# EAGLE design Pwrmon (EAGLE 6.5.0)
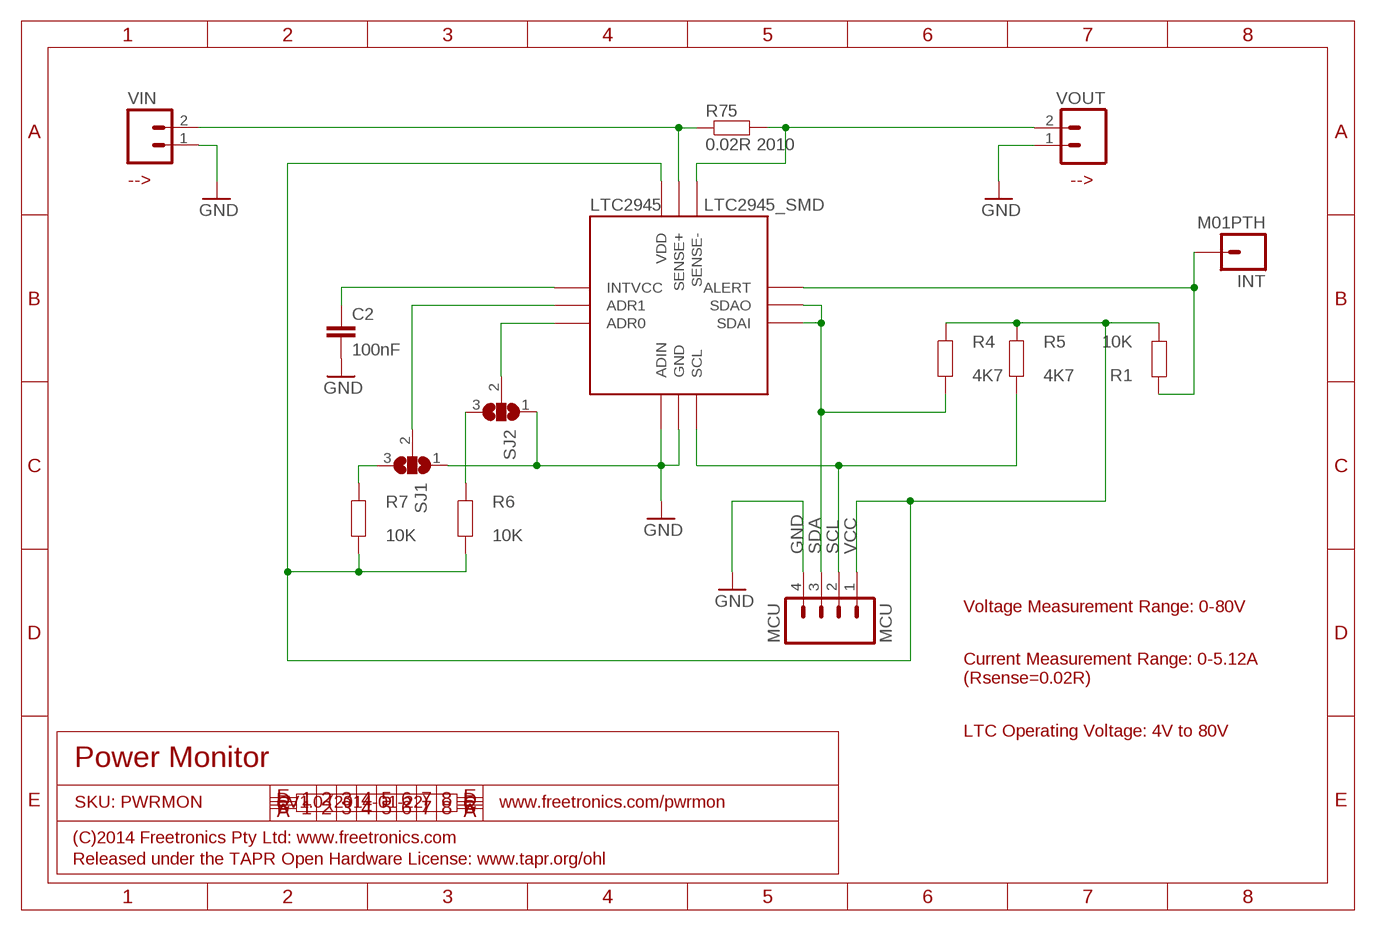
[diagram p0: schematic, sheet 1]

## Parts
C2  100nF  CAP0603  [0603]
INT  M01PTH  [1X01]
LTC2945  LTC2945_SMD  [QFN-12]
MCU  MCU  M04PTH  [1X04]
R1  10K  RESISTOR0603  [0603]
R4  4K7  RESISTOR0603  [0603]
R5  4K7  RESISTOR0603  [0603]
R6  10K  RESISTOR0603  [0603]
R7  10K  RESISTOR0603  [0603]
R75  0.02R 2010  RESISTOR2010  [R2010]
SJ1  SJ2W  [SJ_2]
SJ2  SJ2W  [SJ_2]
VIN  M02PTH  [1X02]
VOUT  M02PTH  [1X02]

## Nets
GND: C2.2 LTC2945.4(ADIN) LTC2945.5(GND) MCU.4 SJ1.1 SJ2.1 VIN.1 VOUT.1
N$1: LTC2945.11(SENSE+) R75.1 VIN.2
N$2: LTC2945.10(SENSE-) R75.2 VOUT.2
N$3: LTC2945.2(ADR1) SJ1.2
N$4: INT.1 LTC2945.9(ALERT) R1.2
N$5: C2.1 LTC2945.1(INTVCC)
N$6: LTC2945.3(ADR0) SJ2.2
N$11: R7.2 SJ1.3
N$12: R6.2 SJ2.3
SCL: LTC2945.6(SCL) MCU.2 R5.1
SDA: LTC2945.7(SDAI) LTC2945.8(SDAO) MCU.3 R4.1
VCC: LTC2945.12(VDD) MCU.1 R1.1 R4.2 R5.2 R6.1 R7.1

## Notes on the sheet
- --> | -->
- Voltage Measurement Range: 0-80V
- Current Measurement Range: 0-5.12A
  (Rsense=0.02R)
- LTC Operating Voltage: 4V to 80V
- Power Monitor
- SKU: PWRMON | V1.0 (2014-01-22) | www.freetronics.com/pwrmon
- (C)2014 Freetronics Pty Ltd: www.freetronics.com
- Released under the TAPR Open Hardware License: www.tapr.org/ohl

## Library data of the parts
C2 = freetronics-master-v1:CAP: Capacitor Standard 0603 ceramic capacitor, and 0.1" leaded capacitor.
INT = freetronics-master-v1.1:M01: Header 1 Standard 1-pin 0.1" header. Use with straight break away headers (SKU : PRT-00116), right angle break away headers (PRT-00553), swiss pins (PRT-00743), machine pins (PRT-00117), and female headers (PRT-00115).
LTC2945 = freetronics-original:LTC2945
MCU = freetronics-master-v1:M04: Header 4 Standard 4-pin 0.1" header. Use with straight break away headers (SKU : PRT-00116), right angle break away headers (PRT-00553), swiss pins (PRT-00743), machine pins (PRT-00117), and female headers (PRT-00115). Molex polarized connector foot print use with SKU : PRT-08231 with associated crimp pins and housings.
R1 R4-R7 = freetronics-master-v1:RESISTOR: Resistor Basic schematic elements and footprints for 0603, 1206, and PTH 1/10th watt (small) resistors.
R75 = freetronics-original:RESISTOR: Resistor Basic schematic elements and footprints for 0603, 1206, and PTH 1/10th watt (small) resistors.
SJ1 SJ2 = freetronics-master-v1.1:SJ2W: SMD solder JUMPER
VIN VOUT = freetronics-master-v1.1:M02: Header 2 Standard 2-pin 0.1" header. Use with straight break away headers (SKU : PRT-00116), right angle break away headers (PRT-00553), swiss pins (PRT-00743), machine pins (PRT-00117), and female headers (PRT-00115). Molex polarized connector foot print use with SKU : PRT-08233 with associated crimp pins and housings.

## Board
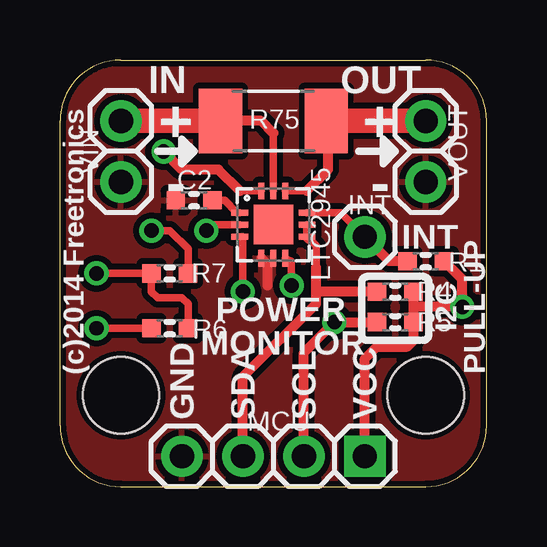
[diagram p1: board, top side]
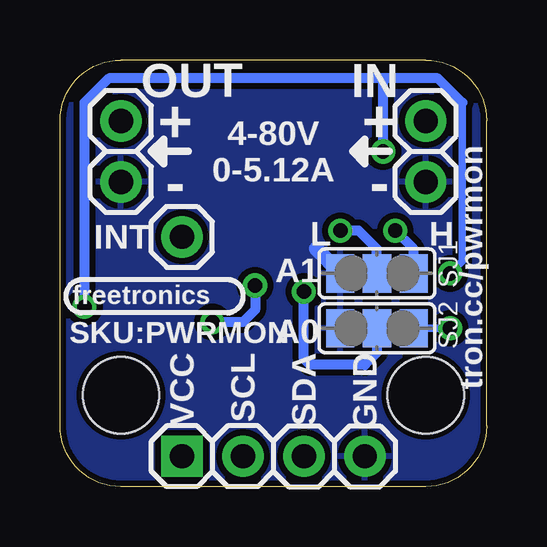
[diagram p2: board, bottom side, seen from below]

Size 17.78 x 17.78 mm. Coordinates in mm from the lower left corner, seen from the top.
Outline: 15.24,0 arc90 17.78,2.54 17.78,15.24 arc90 15.24,17.78 2.54,17.78 arc90 0,15.24 0,2.54 arc90 2.54,0 15.24,0
Copper layers (1*16): Top 0.035mm / dielectric 1.5mm / Bottom 0.035mm
Design rules "default *": minimum track width 8mil, minimum drill 15mil, track to track 10mil, track to pad 10mil, pad to pad 10mil, via to via 10mil, smd to smd 8mil, copper to edge 10mil, drill to drill 8mil, minimum pad ring 14mil, minimum via ring 8mil, stop-mask expansion 4mil, vias tented up to drill 25mil, thermal gap 10mil
Holes 3.17 mm at 15.24,3.81 2.54,3.81

### Footprints (pad centres in the part's own frame; a part is rotated, then mirrored left to right if it is on the bottom)
0603 = smd 0.762 x 0.762: 1 -0.762,0; 2 0.762,0
1X01 = drill 1.016: 1 0,0
QFN-12 = smd 0.7 x 0.25: 1 -1.4,0.5; 2 -1.4,0; 3 -1.4,-0.5; 7 1.4,-0.5; 8 1.4,0; 9 1.4,0.5 | smd 0.25 x 0.7: 4 -0.5,-1.4; 5 0,-1.4; 6 0.5,-1.4; 10 0.5,1.4; 11 0,1.4; 12 -0.5,1.4 | smd 1.65 x 1.65: PAD 0,0
1X04 = drill 1.016 square: 1 0,0 | drill 1.016: 2 2.54,0; 3 5.08,0; 4 7.62,0
R2010 = smd 1.8 x 2.7: 1 -2.2,0; 2 2.2,0
SJ_2 = smd 1.168 x 1.6: 1 -1.524,0; 2 0,0; 3 1.524,0
1X02 = drill 1.016: 1 0,0; 2 2.54,0

### Placement (x,y rotation side)
C2  5.59,11.94 180 top
INT  12.7,10.41 0 top
LTC2945  8.89,10.92 0 top
MCU  12.7,1.27 180 top
R1  15.24,9.4 180 top
R4  13.97,8.13 0 top
R5  13.97,6.86 0 top
R6  4.57,6.6 180 top
R7  4.57,8.89 0 top
R75  8.89,15.24 0 top
SJ1  4.57,8.89 0 bottom
SJ2  4.57,6.6 0 bottom
VIN  2.54,12.7 90 top
VOUT  15.24,12.7 90 top

### Tracks (layer width: path | path; a pad name or v marks a point on that pad's centre or on a via)
GND
  Top 0.406: LTC2945.4 8.64,9.28 8.64,8.38
  Bottom 0.61: SJ1.1 7.11,9.91
  pour Top: 0,15.24 arc-90 2.54,17.78 15.24,17.78 arc-90 17.78,15.24 17.78,2.54 arc-90 15.24,0 2.54,0 arc-90 0,2.54
  pour Bottom: 0,15.24 arc-90 2.54,17.78 15.24,17.78 arc-90 17.78,15.24 17.78,2.54 arc-90 15.24,0 2.54,0 arc-90 0,2.54
N$1
  Top 0.305: LTC2945.11 8.89,14.73
  Top 0.406: 8.89,14.73 8.38,15.24 R75.1
  Top 1.016: VIN.2 R75.1
N$2
  Top 0.305: LTC2945.10 10.29,12.32
  Top 0.406: 10.29,12.32 11.18,13.21 11.18,15.15 R75.2
  Top 1.016: VOUT.2 R75.2
N$3  (via drill 0.6)
  Top 0.305: LTC2945.2 6.35,10.92 v6.1,10.67
  Bottom 0.406: SJ1.2 4.57,9.91 5.33,10.67 v6.1,10.67
N$4
  Top 0.305: LTC2945.9 11.69,11.42 INT.1
  Top 0.406: R1.2 13.72,9.4 INT.1
N$5
  Top 0.305: LTC2945.1 7.37,11.42 6.86,11.94 C2.1
N$6  (via drill 0.6)
  Top 0.305: LTC2945.3 7.62,10.42 v7.62,8.13
  Bottom 0.406: SJ2.2 4.57,5.59 5.08,5.08 7.37,5.08 7.62,5.33 v7.62,8.13
N$11  (via drill 0.6)
  Top 0.305: R7.2 5.33,9.91 4.57,10.67 v3.81,10.67
  Bottom 0.406: SJ1.3 3.05,9.91 v3.81,10.67
N$12  (via drill 0.6)
  Top 0.305: R6.2 v1.52,6.6
  Bottom 0.305: SJ2.3 v1.52,6.6
SCL  (via drill 0.6)
  Top 0.305: LTC2945.6 9.64,9.4 v9.65,8.38
  Top 0.406: MCU.2 10.16,5.59 v11.43,6.86 R5.1
  Bottom 0.406: v9.65,8.38 9.65,7.37 10.16,6.86 v11.43,6.86
SDA
  Top 0.305: LTC2945.8 LTC2945.7 10.67,10.04 10.67,9.14
  Top 0.406: MCU.3 7.62,4.57 10.67,7.62 10.67,8.13 | 10.67,8.13 10.67,9.14 | 10.41,10.3 LTC2945.7 | R4.1 10.67,8.13
VCC  (via drill 0.6)
  Top 0.305: LTC2945.12 7.49,12.32 | v1.52,8.89 R7.1 3.81,8.13 4.06,7.87 5.08,7.87 5.33,7.62 R6.1
  Top 0.406: MCU.1 12.7,5.33 13.21,5.84 14.48,5.84 14.73,6.1 R5.2 14.73,7.37 | 14.73,7.37 R4.2 | 7.49,12.32 6.6,13.21 5.08,13.21 v4.32,13.97 | 14.73,7.37 14.86,7.49 v16.76,7.49 16.76,8.64 R1.1
  Bottom 0.305: 1.02,16 1.02,9.4 v1.52,8.89
  Bottom 0.406: 1.02,16 2.03,17.02 4.32,17.02 | 4.32,17.02 15.75,17.02 16.76,16 v16.76,7.49 | v4.32,13.97 4.32,17.02

### Text on the board
tPlace: (c)2014 Freetronics | IN | OUT | + | + | - | - | INT | POWER | I2C / PULL-UP | MONITOR | GND | SDA | SCL | VCC
bPlace: IN | OUT | + | + | tron.cc/pwrmon | - | 4-80V / 0-5.12A | - | H | A1 | L | INT | freetronics | A0 | GND | SDA | SCL | VCC | SKU:PWRMON